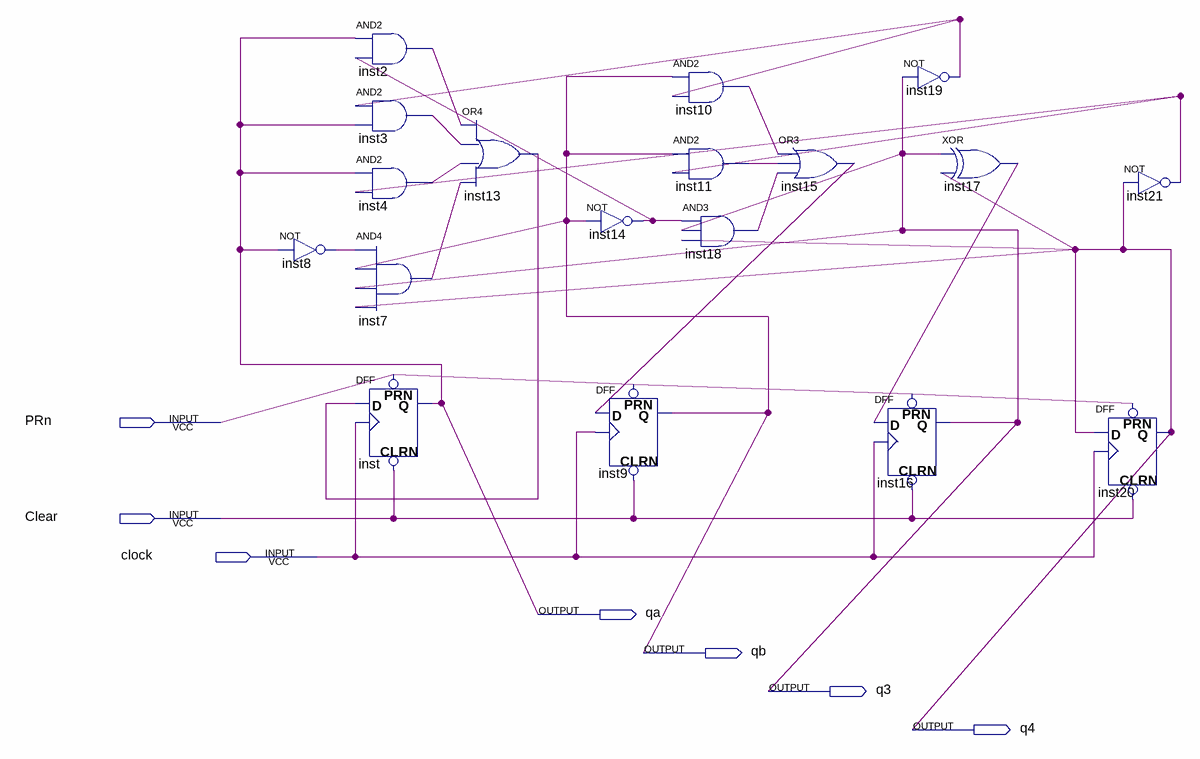
[diagram p0: schematic sheet]
// Quartus schematic question2a.bdf as structural Verilog: 18 symbols, 7 pins
module question2a (
  input  PRn,
  input  Clear,
  input  clock,
  output qa,
  output qb,
  output q3,
  output q4
);

  wire inst2_out, inst3_out, inst4_out, inst7_out, inst8_out, inst10_out, inst11_out, inst13_out, inst14_out,
       inst15_out, inst17_out, inst18_out, inst19_out, inst21_out;

  not inst8 (inst8_out, qa);
  and inst2 (inst2_out, qa, inst14_out);
  and inst3 (inst3_out, inst19_out, qa);
  and inst4 (inst4_out, qa, inst21_out);
  and inst7 (inst7_out, inst8_out, qb, q3, q4);
  DFF inst (.CLRN(Clear), .CLK(clock), .D(inst13_out), .PRN(PRn), .Q(qa));
  or inst13 (inst13_out, inst2_out, inst3_out, inst4_out, inst7_out);
  not inst14 (inst14_out, qb);
  DFF inst9 (.CLRN(Clear), .CLK(clock), .D(inst15_out), .PRN(PRn), .Q(qb));
  and inst10 (inst10_out, qb, inst19_out);
  and inst11 (inst11_out, qb, inst21_out);
  and inst18 (inst18_out, inst14_out, q3, q4);
  or inst15 (inst15_out, inst10_out, inst11_out, inst18_out);
  DFF inst16 (.CLRN(Clear), .CLK(clock), .D(inst17_out), .PRN(PRn), .Q(q3));
  not inst19 (inst19_out, q3);
  xor inst17 (inst17_out, q3, q4);
  DFF inst20 (.CLRN(Clear), .CLK(clock), .D(q4), .PRN(PRn), .Q(q4));
  not inst21 (inst21_out, q4);
endmodule
